# Altium schematic sheet 1_uC.SchDoc
size 414 x 293 mm; SheetNumber: 1; SheetTotal: 3; PageSetup: Record=PageOptionsZCenterHorizontal=TrueZCenterVertical=TrueZPrintScale=1.00ZXCorrection=0.00ZYCorrection=0.00ZPrintKind=1ZBorderSize=5000000ZLeftOffset=0ZBottomOffset=0ZOrientation=2ZPaperLength=1000ZPaperWidth=1000ZScale=100ZPaperSource=7ZPrintQuality=-4ZMediaType=1ZDitherType=10ZPaperKind=A3ZPrintScaleMode=0; Razrabotal: {Разработал}; Proveril: {Проверил}; Tkontr: {Т.контр.}; Nkontr: {Н.контр.}; Ytverdil: {Утвердил}; Nazvanie1: {Название1}; Nazvanie2: {Название2}; Oboznachenie: {Обозначение}
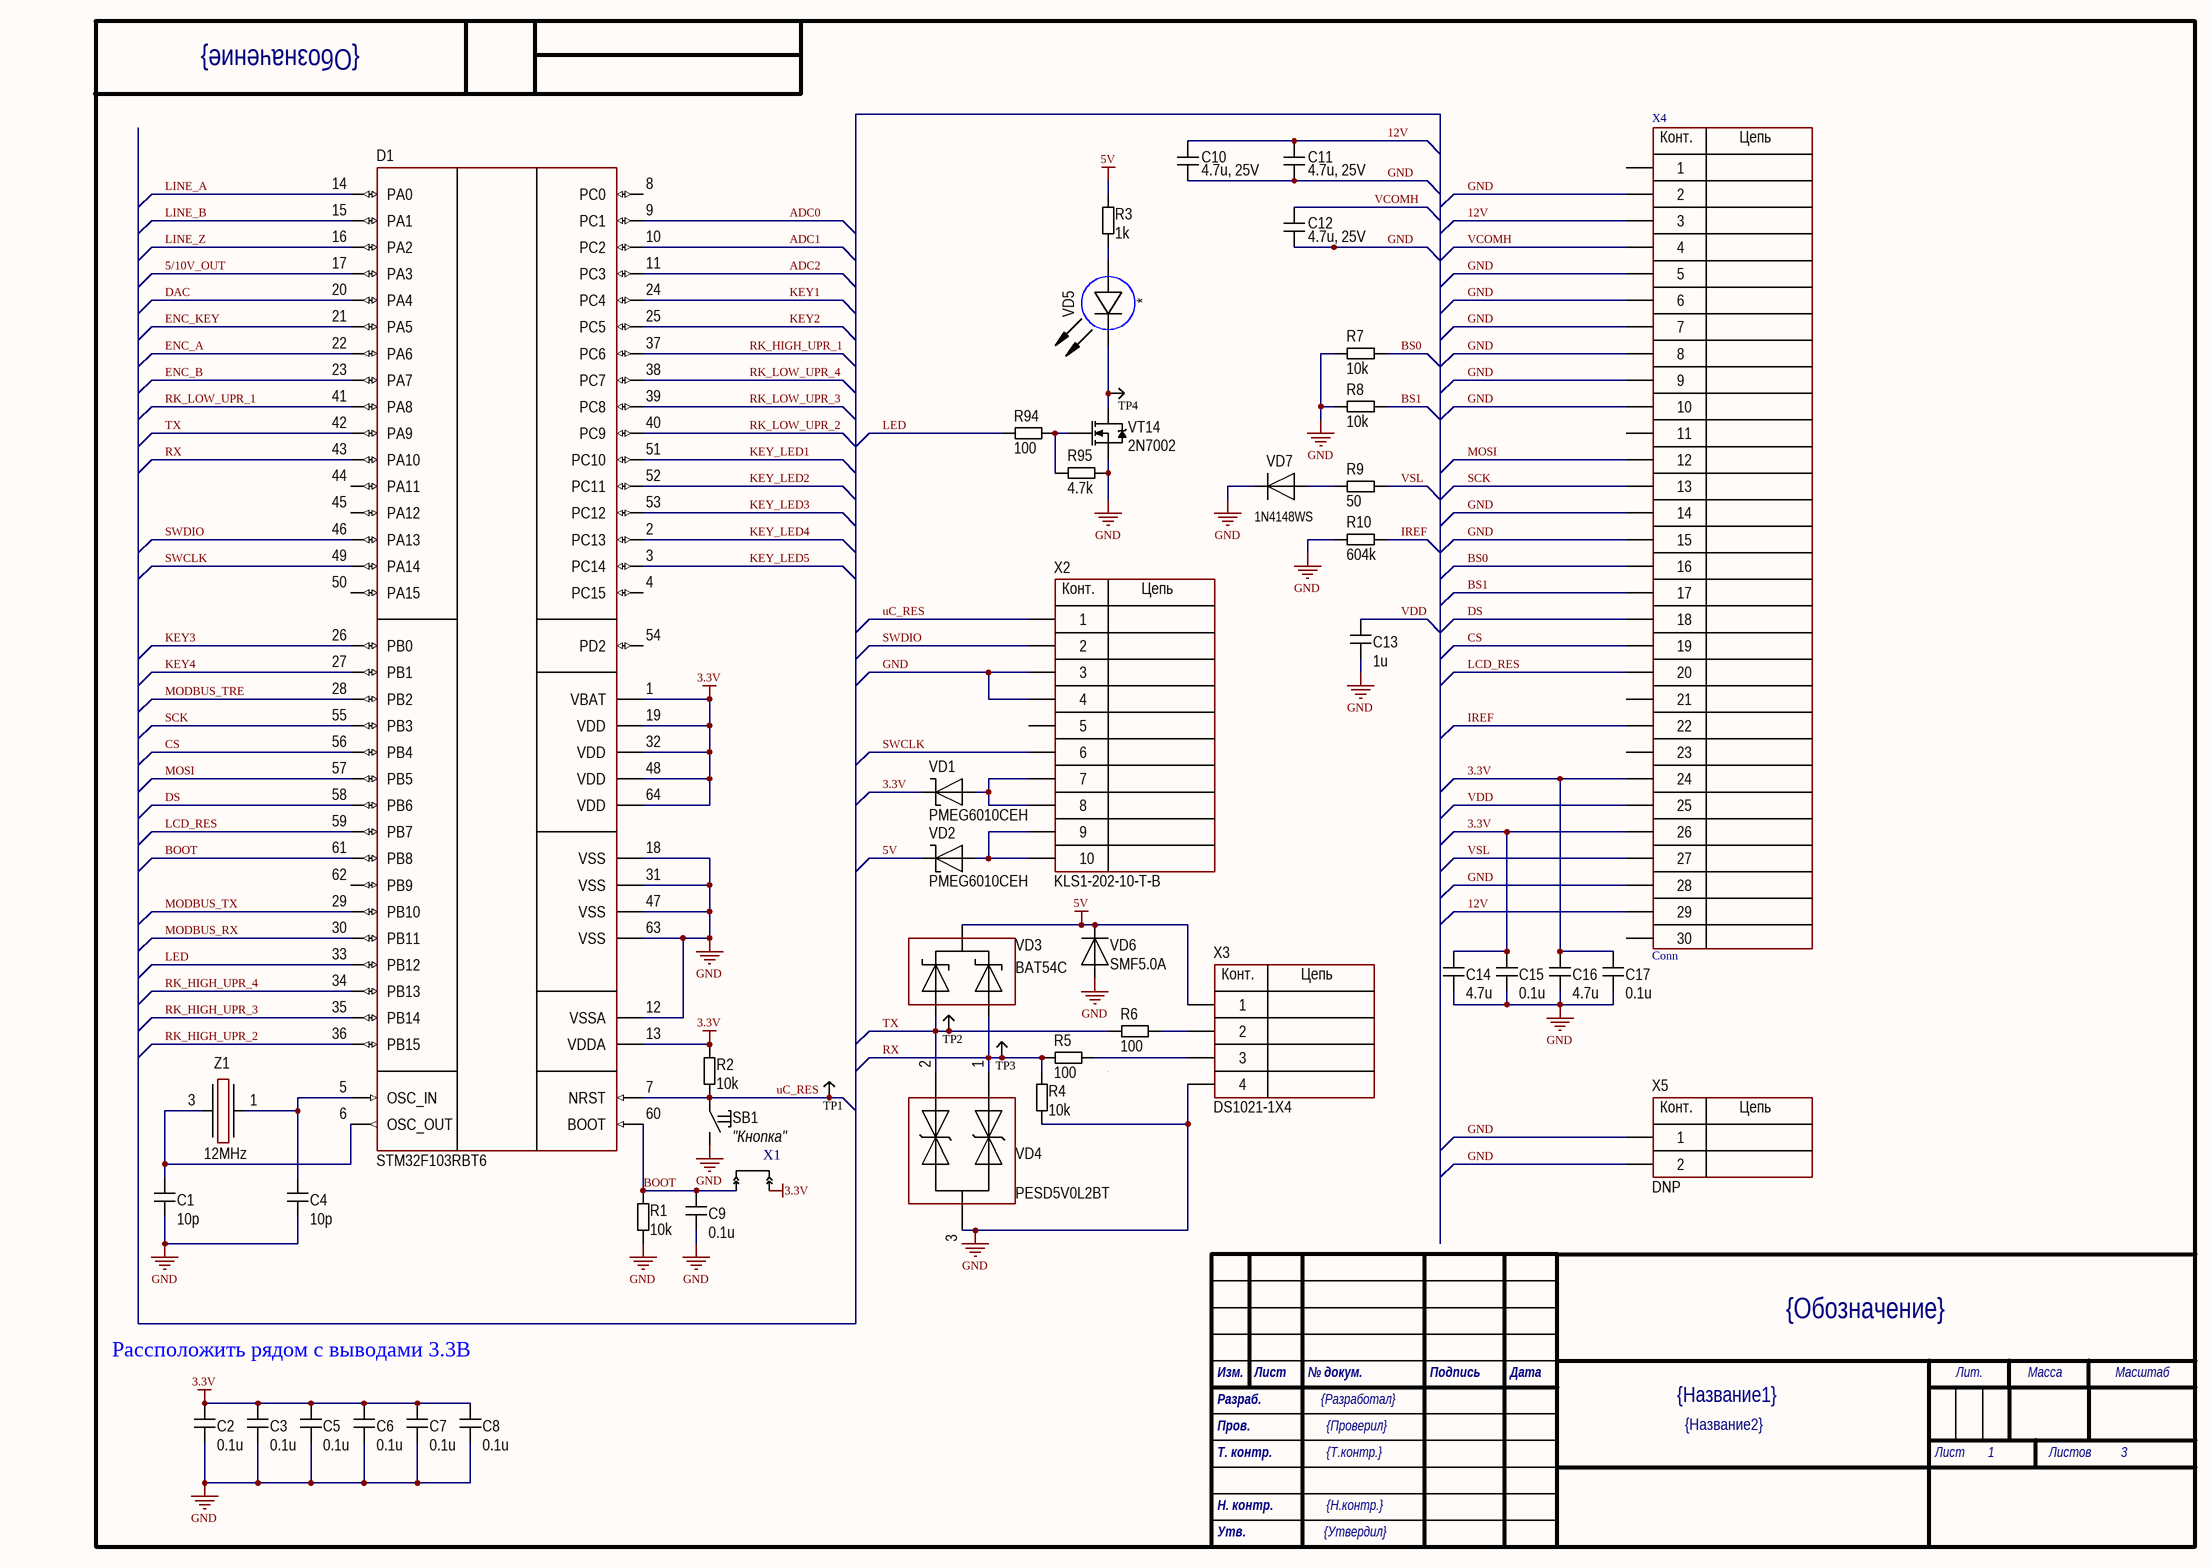
[diagram p0: 1_uC.SchDoc]

## Parts
C1  10p  [CH0402C]
C2  0.1u  [CH0603C]
C3  0.1u  [CH0603C]
C4  10p  [CH0402C]
C5  0.1u  [CH0603C]
C6  0.1u  [CH0603C]
C7  0.1u  [CH0603C]
C8  0.1u  [CH0603C]
C9  0.1u  [CH0603C]
C10  4.7u, 25V  [CH0805C]
C11  4.7u, 25V  [CH0805C]
C12  4.7u, 25V  [CH0805C]
C13  1u  [CH0603C]
C14  4.7u  [CH0603C]
C15  0.1u  [CH0603C]
C16  4.7u  [CH0603C]
C17  0.1u  [CH0603C]
D1  STM32F103RBT6  [64-LQFP]
R1  10k  [CH0603R]
R2  10k  [CH0603R]
R3  1k  [CH0805R]
R4  10k  [CH0603R]
R5  100  [CH0603R]
R6  100  [CH0603R]
R7  10k  [CH0603R]
R8  10k  [CH0603R]
R9  50  [CH0603R]
R10  604k  [CH0603R]
R94  100  [CH0603R]
R95  4.7k  [CH0603R]
SB1  "Кнопка"  [TL1014BF160QG]
TP1  (no value)  [TestPoint]
TP2  (no value)  [TestPoint]
TP3  (no value)  [TestPoint]
TP4  (no value)  [TestPoint]
VD1  PMEG6010CEH  [SOD123F]
VD2  PMEG6010CEH  [SOD123F]
VD3  BAT54C  [SOT23_123]
VD4  PESD5V0L2BT  [SOT23_132]
VD5  *  [CH0603LB]
VD6  SMF5.0A  [SOD123F]
VD7  1N4148WS  [SOD323]
VT14  2N7002  [SOT23_123]
X1  JMP-2  [PLS-2]  (value not drawn)
X2  KLS1-202-10-T-B  [CON: IDC-10MS]
X3  DS1021-1X4  [CON: PLS-4]
X4  Conn  [FPC-30]
X5  DNP  [CON: PLS-2]
Z1  12MHz  [OSC: 2520]

## Nets
3.3V: C2.2 C3.2 C5.2 C6.2 C7.2 C8.2 C14.2 C15.2 C16.2 C17.2 D1.1(VBAT) D1.13(VDDA) D1.19(VDD) D1.32(VDD) D1.48(VDD) D1.64(VDD) R2.2 VD1.2 X1.2 X4.24 X4.26
5V: R3.2 VD2.2 VD3.2 VD6.2 X3.1
GND: C1.1 C2.1 C3.1 C4.1 C5.1 C6.1 C7.1 C8.1 C9.1 C10.1 C11.1 C12.1 C13.1 C14.1 C15.1 C16.1 C17.1 D1.12(VSSA) D1.18(VSS) D1.31(VSS) D1.47(VSS) D1.63(VSS) R1.1 R4.2 R7.1 R8.1 R10.1 R95.1 SB1.2 VD4.3 VD6.1 VD7.2 VT14.3(S) X2.3 X2.4 X3.4 X4.2 X4.5 X4.6 X4.7 X4.8 X4.9 X4.10 X4.14 X4.15 X4.28 X5.1 X5.2
5/10V_OUT: D1.17(PA3)
12V: C10.2 C11.2 X4.3 X4.29
ADC0: D1.9(PC1)
ADC1: D1.10(PC2)
ADC2: D1.11(PC3)
BOOT: C9.2 D1.60(BOOT) D1.61(PB8) R1.2 X1.1
BS0: R7.2 X4.16
BS1: R8.2 X4.17
CS: D1.56(PB4) X4.19
DAC: D1.20(PA4)
DS: D1.58(PB6) X4.18
ENC_A: D1.22(PA6)
ENC_B: D1.23(PA7)
ENC_KEY: D1.21(PA5)
IREF: R10.2 X4.22
KEY1: D1.24(PC4)
KEY2: D1.25(PC5)
KEY3: D1.26(PB0)
KEY4: D1.27(PB1)
KEY_LED1: D1.51(PC10)
KEY_LED2: D1.52(PC11)
KEY_LED3: D1.53(PC12)
KEY_LED4: D1.2(PC13)
KEY_LED5: D1.3(PC14)
LCD_RES: D1.59(PB7) X4.20
LED: D1.33(PB12) R94.2
LINE_A: D1.14(PA0)
LINE_B: D1.15(PA1)
LINE_Z: D1.16(PA2)
MODBUS_RX: D1.30(PB11)
MODBUS_TRE: D1.28(PB2)
MODBUS_TX: D1.29(PB10)
MOSI: D1.57(PB5) X4.12
RK_HIGH_UPR_1: D1.37(PC6)
RK_HIGH_UPR_2: D1.36(PB15)
RK_HIGH_UPR_3: D1.35(PB14)
RK_HIGH_UPR_4: D1.34(PB13)
RK_LOW_UPR_1: D1.41(PA8)
RK_LOW_UPR_2: D1.40(PC9)
RK_LOW_UPR_3: D1.39(PC8)
RK_LOW_UPR_4: D1.38(PC7)
RX: D1.43(PA10) R4.1 R5.2 TP3.0 VD3.1 VD4.1
SCK: D1.55(PB3) X4.13
SWCLK: D1.49(PA14) X2.6
SWDIO: D1.46(PA13) X2.2
TX: D1.42(PA9) R6.2 TP2.0 VD3.3 VD4.2
uC_RES: D1.7(NRST) R2.1 SB1.1 TP1.0 X2.1
VCOMH: C12.2 X4.4
VDD: C13.2 X4.25
VSL: R9.2 X4.27
NetC1_2: C1.2 D1.6(OSC_OUT) Z1.3
NetC4_2: C4.2 D1.5(OSC_IN) Z1.1
NetR3_1: R3.1 VD5.1(A)
NetR5_1: R5.1 X3.3
NetR6_1: R6.1 X3.2
NetR9_1: R9.1 VD7.1
NetR94_1: R94.1 R95.2 VT14.1(G)
NetTP4_0: TP4.0 VD5.2(C) VT14.2(D)
NetVD1_1: VD1.1 X2.7 X2.8
NetVD2_1: VD2.1 X2.9 X2.10

Not connected (* = marked no-connect by the designer): D1 4(PC15) 8(PC0) 44(PA11) 45(PA12) 50(PA15) 54(PD2) 62(PB9); X2 5; X4 1 11 21 23 30

## Notes on the sheet
- Рассположить рядом с выводами 3.3В
- Изм.
- Лист
- № докум.
- Подпись
- Дата
- Лит.
- Масса
- Масштаб
- Пров.
- Разраб.
- Т. контр.
- Н. контр.
- Листов
- Утв.
- (in symbol 2-Connector) Конт.; Цепь
- (in symbol 4-Connector) Конт.; Цепь
- (in symbol 10-Connector) Конт.; Цепь
- (in symbol 30-Connector) Конт.; Цепь

## Library data of the parts
C1 C4 = Capacitor: Model: AC0402JRNPO9BN100; Manufacturer: *; HelpURL: *; ComponentKind: *; Value: 10p
C2 C3 C5-C9 C15 C17 = Capacitor: Model: 06035C104JAT2A; Manufacturer: *; HelpURL: *; ComponentKind: *; Value: 0.1u
C10-C12 = Capacitor: Model: 08053C475KAT2A; Manufacturer: *; HelpURL: *; ComponentKind: *; Value: 4.7u, 25V
C13 = Capacitor: Model: 0603B105K250NT; Manufacturer: *; HelpURL: *; ComponentKind: *; Value: 1u
C14 C16 = Capacitor: Model: 06036D475KAT2A; Manufacturer: *; HelpURL: *; ComponentKind: *; Value: 4.7u
D1 = STM32F103RBT6: Cortex-M3; Manufacturer: STMicroelectronics; Model: STM32F103RBT6; HelpURL: https://www.digikey.com/product-detail/en/stmicroelectronics/STM32F103RBT6/497-6066-ND/1646341; ComponentKind: 64-LQFP
R1 R2 R4 R7 R8 = Resistor: Model: CR0603-FX-1002ELF; Manufacturer: *; HelpURL: *; ComponentKind: *; Value: 10k
R3 = Resistor: Model: CR0805-FX-1001ELF; Manufacturer: *; HelpURL: *; ComponentKind: *; Value: *
R5 R6 R94 = Resistor: Model: CR0603-JW-101ELF; Manufacturer: *; HelpURL: *; ComponentKind: *; Value: 100
R9 = Resistor: Model: CR0603-FX-49R9ELF; Manufacturer: *; HelpURL: *; ComponentKind: *; Value: 50
R10 = Resistor: Model: CR0603-FX-6043ELF; Manufacturer: *; HelpURL: *; ComponentKind: *; Value: 604k
R95 = Resistor: Model: CR0603-FX-4701ELF; Manufacturer: *; HelpURL: *; ComponentKind: *; Value: 4.7k
SB1 = Tactile switches: 6x6 mm; Manufacturer: *; Model: TL1014BF160QG; HelpURL: *; ComponentKind: *
TP1-TP4 = TestPoint
VD1 VD2 = Diod Schottky: ComponentKind: *; Manufacturer: *; Model: PMEG6010CEH; HelpURL: *
VD3 = Diod Schottky Array v.1: ComponentKind: *; Manufacturer: *; Model: BAT54C; HelpURL: *
VD4 = TVS Array: ComponentKind: *; Manufacturer: *; Model: PESD5V0L2BT; HelpURL: *
VD5 = LED_1: Model: KPT-1608SGC; Manufacturer: *; HelpURL: *; ComponentKind: *; Value: *
VD6 = Diod: Part Num: SMAF5.0A; ComponentKind: *; Manufacturer: *; Model: SMF5.0A; HelpURL: *
VD7 = Diod: ComponentKind: *; Manufacturer: *; Model: 1N4148WS; HelpURL: *
VT14 = N-chanel: Mosfet; Model: 2N7002; Manufacturer: *; ComponentKind: *; HelpURL: *
X1 = JMP-2: Model: DNP
X2 = 10-Connector: Model: KLS1-202-10-T-B; Manufacturer: *; HelpURL: *; ComponentKind: *
X3 = 4-Connector: Model: DS1021-1X4; Manufacturer: *; HelpURL: *; ComponentKind: *
X4 = 30-Connector: Model: KLS1-242G-2.0-30-T-R
X5 = 2-Connector: Model: DNP; Manufacturer: *; HelpURL: *; ComponentKind: *
Z1 = Oscillator: Model: ECS-120-10-36B2-JTN-TR; Manufacturer: *; HelpURL: *; ComponentKind: *; Value: 12MHz